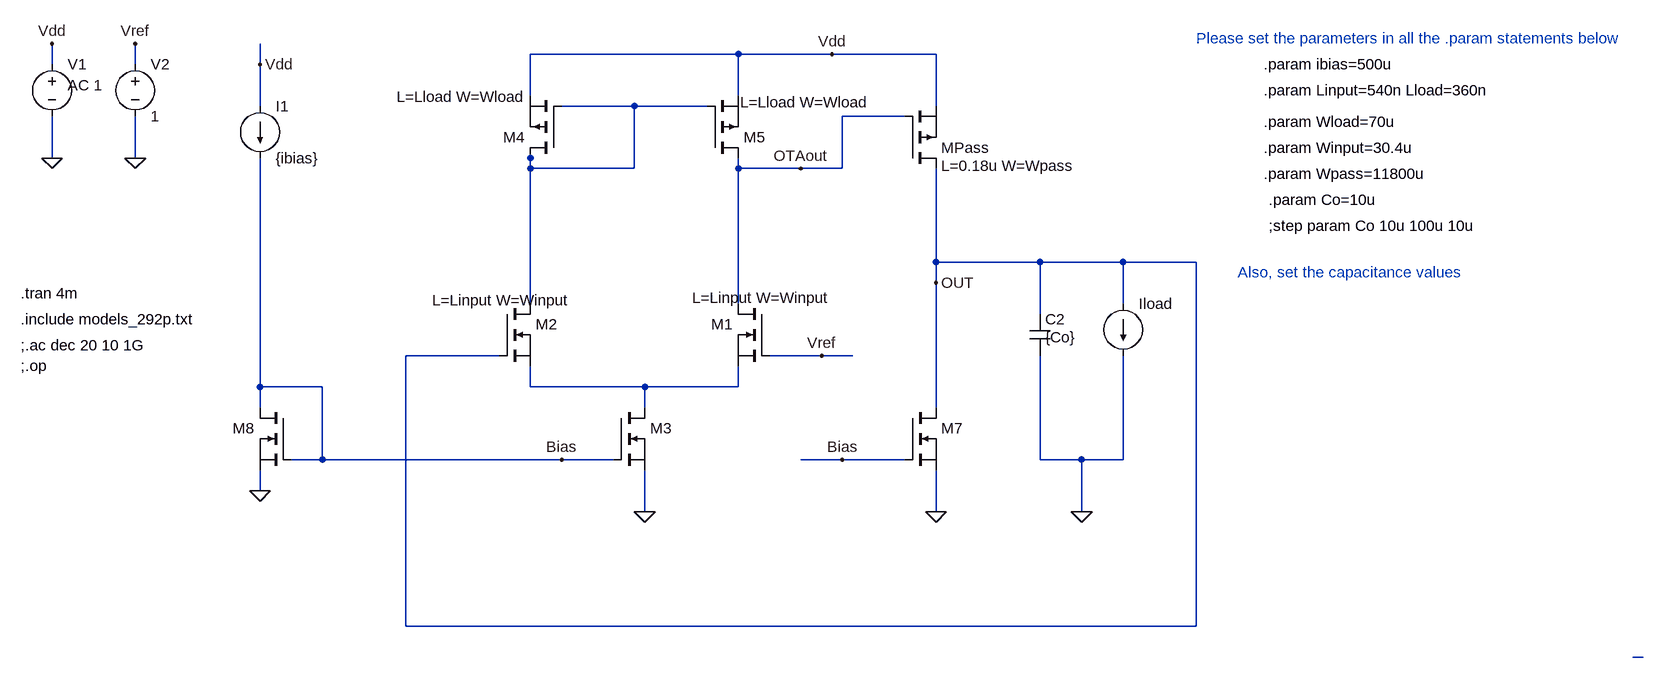
[diagram p0: schematic LDO_Load_Transient_Analysis.asc]
LDO_Load_Transient_Analysis.asc, the LTspice schematic file:
Version 4
SHEET 1 2224 1020
WIRE 288 -288 -32 -288
WIRE 432 -288 288 -288
WIRE 592 -288 432 -288
WIRE -768 -272 -768 -304
WIRE -640 -272 -640 -304
WIRE -448 -272 -448 -304
WIRE -32 -224 -32 -288
WIRE 288 -224 288 -288
WIRE -448 -208 -448 -272
WIRE 128 -208 16 -208
WIRE 240 -208 128 -208
WIRE 592 -208 592 -288
WIRE 544 -192 448 -192
WIRE -768 -128 -768 -192
WIRE -640 -128 -640 -192
WIRE -32 -128 -32 -144
WIRE -32 -112 -32 -128
WIRE 128 -112 128 -208
WIRE 128 -112 -32 -112
WIRE 288 -112 288 -128
WIRE 384 -112 288 -112
WIRE 448 -112 448 -192
WIRE 448 -112 384 -112
WIRE 592 32 592 -112
WIRE 752 32 592 32
WIRE 880 32 752 32
WIRE 992 32 880 32
WIRE 592 64 592 32
WIRE -32 96 -32 -112
WIRE 288 96 288 -112
WIRE 880 96 880 32
WIRE 752 112 752 32
WIRE -80 176 -224 176
WIRE 416 176 336 176
WIRE 464 176 416 176
WIRE -448 224 -448 -128
WIRE -352 224 -448 224
WIRE -32 224 -32 192
WIRE 144 224 -32 224
WIRE 288 224 288 192
WIRE 288 224 144 224
WIRE -448 256 -448 224
WIRE 144 256 144 224
WIRE 592 256 592 64
WIRE -352 336 -352 224
WIRE -352 336 -400 336
WIRE 16 336 -352 336
WIRE 96 336 16 336
WIRE 448 336 384 336
WIRE 544 336 448 336
WIRE 752 336 752 176
WIRE 816 336 752 336
WIRE 880 336 880 176
WIRE 880 336 816 336
WIRE -448 384 -448 352
WIRE 144 416 144 352
WIRE 592 416 592 352
WIRE 816 416 816 336
WIRE -224 592 -224 176
WIRE 992 592 992 32
WIRE 992 592 -224 592
WIRE 1680 640 1664 640
FLAG 144 416 0
FLAG 592 416 0
FLAG 448 336 Bias
FLAG 16 336 Bias
FLAG 592 64 OUT
FLAG -768 -128 0
FLAG -768 -304 Vdd
FLAG 432 -288 Vdd
FLAG -640 -128 0
FLAG -640 -304 Vref
FLAG 416 176 Vref
FLAG -448 384 0
FLAG -448 -272 Vdd
FLAG 816 416 0
FLAG 384 -112 OTAout
DATAFLAG 800 32 "$"
DATAFLAG 288 -48 "$"
DATAFLAG 176 224 "$"
DATAFLAG -32 0 "$"
DATAFLAG -112 336 "$"
DATAFLAG 384 336 ""
SYMBOL nmos 336 96 M0
WINDOW 3 56 72 Invisible 2
WINDOW 39 -93 -9 Left 2
SYMATTR Value nmos292p
SYMATTR SpiceLine L=Linput W=Winput
SYMATTR InstName M1
SYMBOL nmos -80 96 R0
WINDOW 3 56 72 Invisible 2
WINDOW 39 -103 -5 Left 2
SYMATTR Value nmos292p
SYMATTR SpiceLine L=Linput W=Winput
SYMATTR InstName M2
SYMBOL nmos 96 256 R0
WINDOW 3 56 72 Invisible 2
SYMATTR Value nmos292p
SYMATTR InstName M3
SYMATTR SpiceLine L=0.18u W=18.2u
SYMBOL pmos 16 -128 R180
WINDOW 3 56 72 Invisible 2
WINDOW 39 55 94 Left 2
SYMATTR Value pmos292p
SYMATTR SpiceLine L=Lload W=Wload
SYMATTR InstName M4
SYMBOL pmos 240 -128 M180
WINDOW 3 56 72 Invisible 2
WINDOW 39 51 86 Left 2
SYMATTR Value pmos292p
SYMATTR SpiceLine L=Lload W=Wload
SYMATTR InstName M5
SYMBOL pmos 544 -112 M180
WINDOW 3 56 72 Invisible 2
WINDOW 39 56 4 Left 2
SYMATTR Value pmos292p
SYMATTR SpiceLine L=0.18u W=Wpass
SYMATTR InstName MPass
SYMBOL nmos 544 256 R0
WINDOW 3 56 72 Invisible 2
SYMATTR Value nmos292p
SYMATTR InstName M7
SYMATTR SpiceLine L=0.18u W=18.2u
SYMBOL voltage -768 -288 R0
WINDOW 3 24 96 Invisible 2
WINDOW 123 24 48 Left 2
WINDOW 39 0 0 Left 0
SYMATTR Value 1.4
SYMATTR Value2 AC 1
SYMATTR InstName V1
SYMBOL voltage -640 -288 R0
SYMATTR InstName V2
SYMATTR Value 1
SYMBOL nmos -400 256 M0
WINDOW 3 56 72 Invisible 2
SYMATTR Value nmos292p
SYMATTR SpiceLine L=0.18u W=18.2u
SYMATTR InstName M8
SYMBOL current -448 -208 R0
SYMATTR InstName I1
SYMATTR Value {ibias}
SYMBOL current 880 96 R0
WINDOW 3 24 80 Invisible 2
WINDOW 123 0 0 Left 2
WINDOW 39 0 0 Left 2
SYMATTR Value PULSE(10m 100m 1u 200n 200n 1m 2m 10)
SYMATTR InstName Iload
SYMBOL cap 736 112 R0
WINDOW 3 24 36 Left 2
SYMATTR Value {Co}
SYMATTR InstName C2
TEXT -816 120 Left 2 !.include models_292p.txt
TEXT -816 160 Left 2 !;.ac dec 20 10 1G\n;.op
TEXT -816 80 Left 2 !.tran 4m
TEXT 1096 -272 Left 2 !.param ibias=500u
TEXT 1096 -232 Left 2 !.param Linput=540n Lload=360n
TEXT 992 -312 Left 2 ;Please set the parameters in all the .param statements below
TEXT 1096 -184 Left 2 !.param Wload=70u
TEXT 1096 -144 Left 2 !.param Winput=30.4u
TEXT 1096 -104 Left 2 !.param Wpass=11800u
TEXT 1056 48 Left 2 ;Also, set the capacitance values
TEXT 1104 -24 Left 2 !;step param Co 10u 100u 10u
TEXT 1104 -64 Left 2 !.param Co=10u

The netlist it stands for:
* LDO_Load_Transient_Analysis.asc
M1 OTAout Vref N002 N002 nmos292p L=Linput W=Winput
M2 N001 OUT N002 N002 nmos292p L=Linput W=Winput
M3 N002 Bias 0 0 nmos292p L=0.18u W=18.2u
M4 N001 N001 Vdd Vdd pmos292p L=Lload W=Wload
M5 OTAout N001 Vdd Vdd pmos292p L=Lload W=Wload
MPass OUT OTAout Vdd Vdd pmos292p L=0.18u W=Wpass
M7 OUT Bias 0 0 nmos292p L=0.18u W=18.2u
V1 Vdd 0 1.4 AC 1
V2 Vref 0 1
M8 Bias Bias 0 0 nmos292p L=0.18u W=18.2u
I1 Vdd Bias {ibias}
Iload OUT 0 PULSE(10m 100m 1u 200n 200n 1m 2m 10)
C2 OUT 0 {Co}
.model NMOS NMOS
.model PMOS PMOS
.lib standard.mos
.include models_292p.txt
;.ac dec 20 10 1G
;.op
.tran 4m
.param ibias=500u
.param Linput=540n Lload=360n
* Please set the parameters in all the .param statements below
.param Wload=70u
.param Winput=30.4u
.param Wpass=11800u
* Also, set the capacitance values
;step param Co 10u 100u 10u
.param Co=10u
.backanno
.end